# Altium project 3FingerRobotV2.PrjPcb
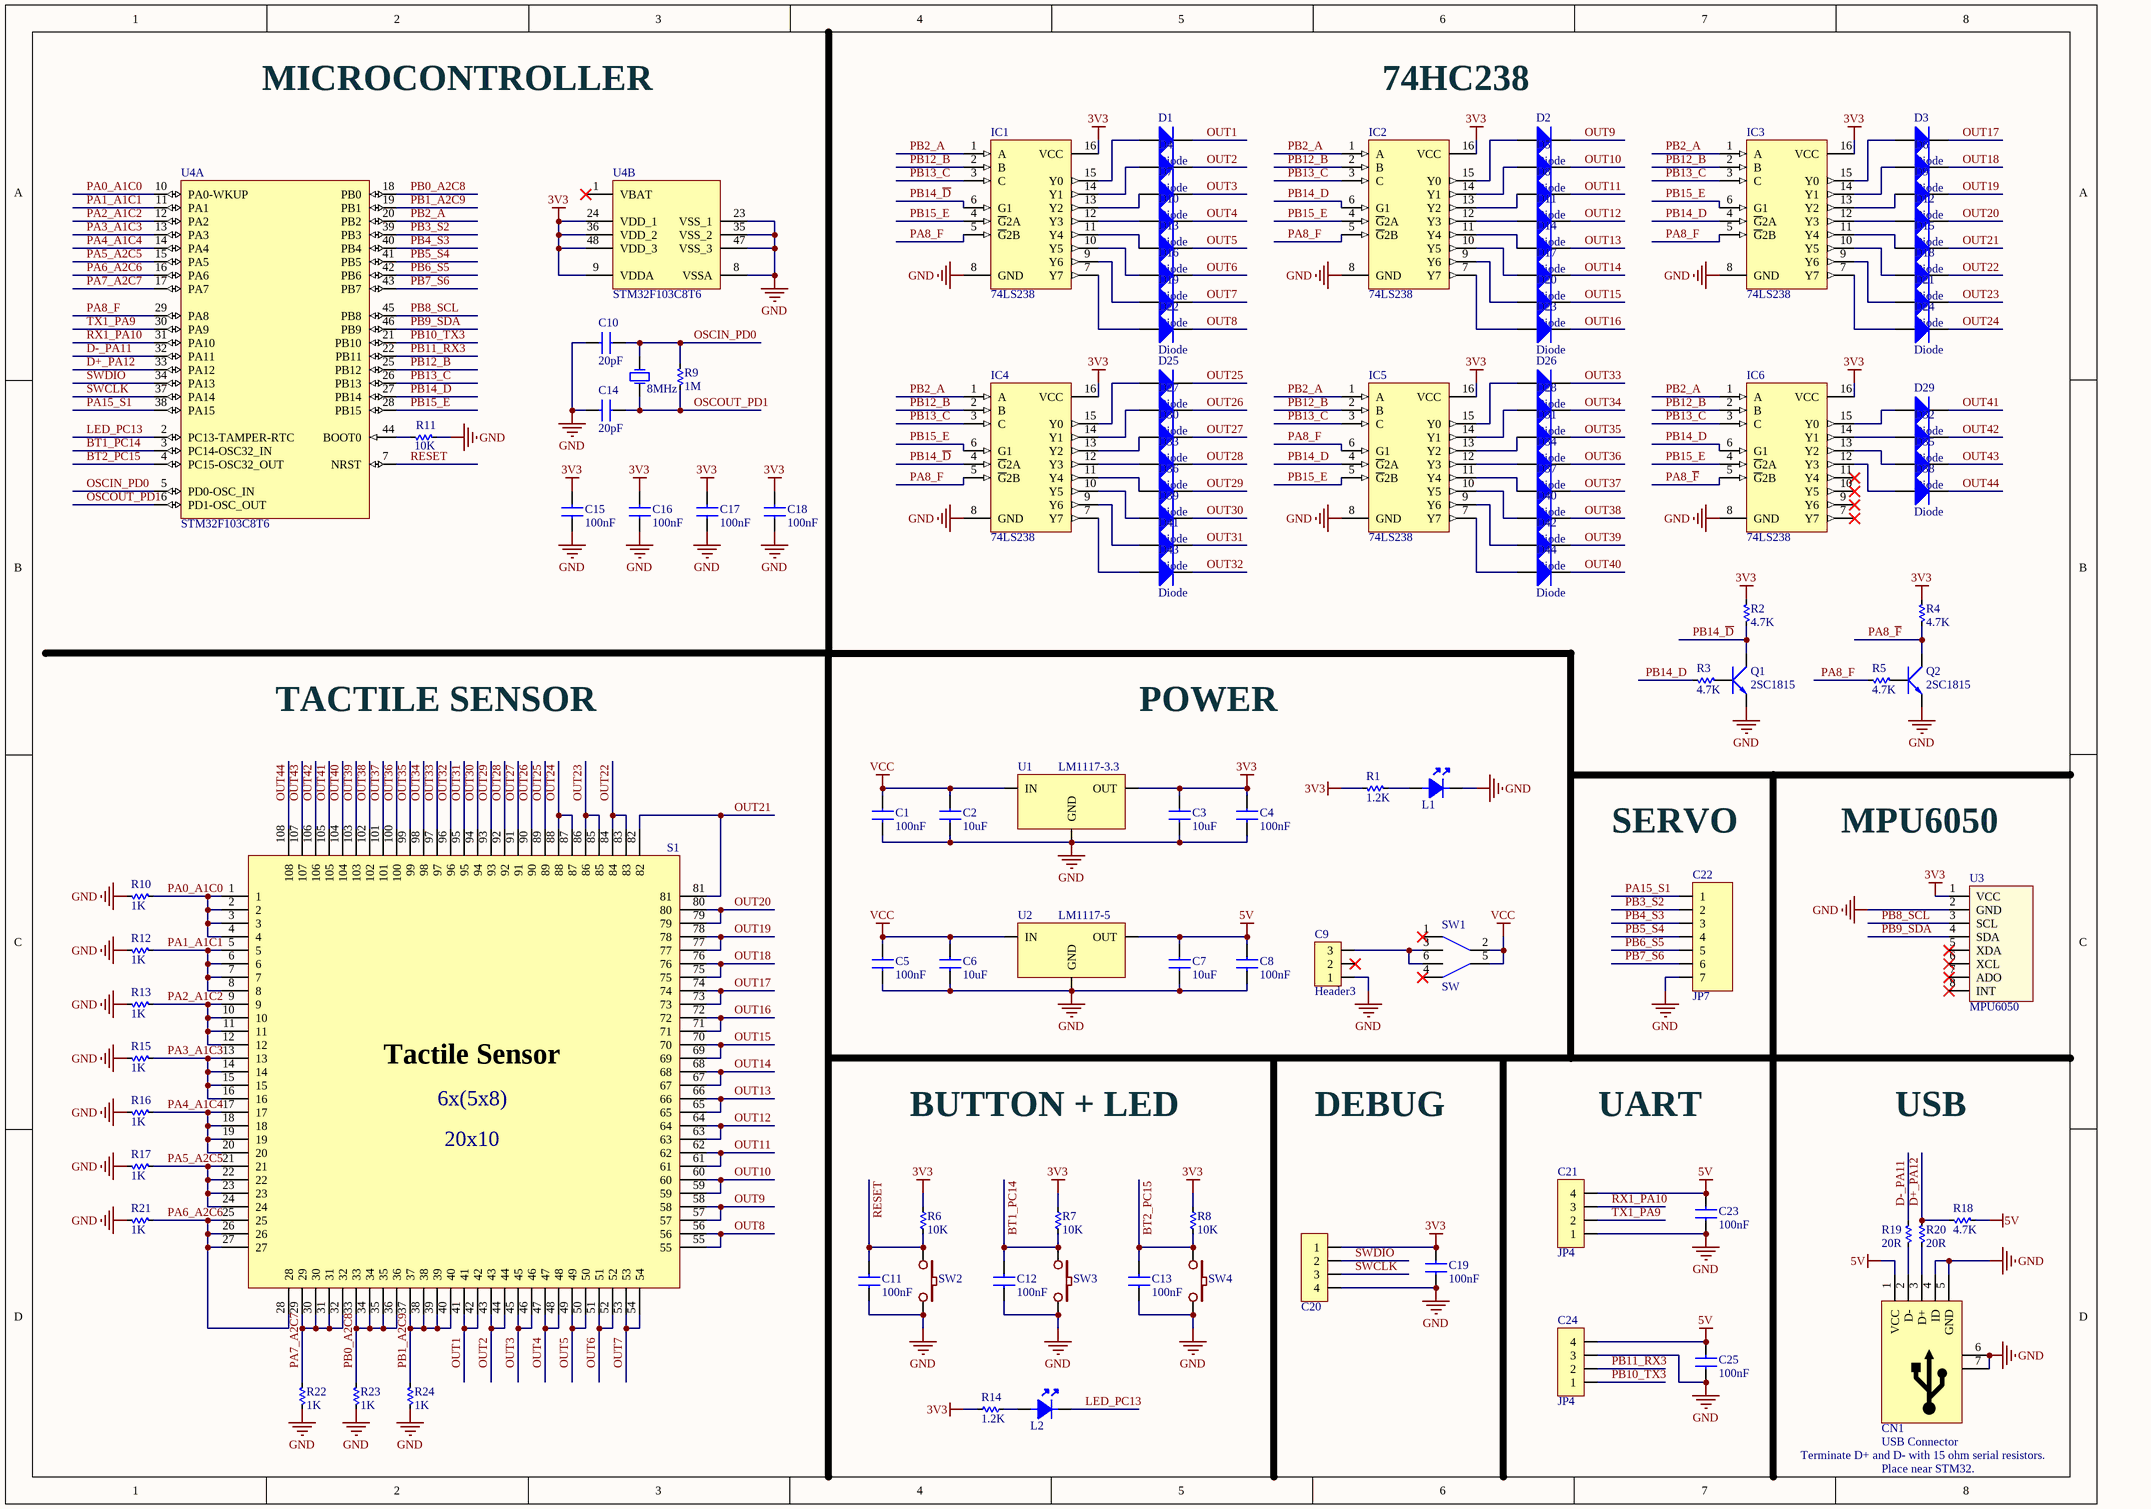
[diagram p0: 3FingerRobotV2.SchDoc]
1 sheet, 114 parts. Net scope: global (net labels, ports and power ports of the same name join across sheets).
Board file: 3FingerRobotV2.~(1).PcbDoc

## Sheet 3FingerRobotV2.SchDoc: Van Thinh
size A3; SheetNumber: 1; SheetTotal: 1; ENG_APP_DATE: --/--/--; DSN_APP_DATE: --/--/--; CHK_APP_DATE: --/--/--

### Parts
C1  Capacitance: 100nF  [C0805-2.01-1.25-0.94]  (hidden comment: Capacitor 0805)
C2  Capacitance: 10uF  [C0805-2.01-1.25-0.94]  (hidden comment: Capacitor 0805)
C3  Capacitance: 10uF  [C0805-2.01-1.25-0.94]  (hidden comment: Capacitor 0805)
C4  Capacitance: 100nF  [C0805-2.01-1.25-0.94]  (hidden comment: Capacitor 0805)
C5  Capacitance: 100nF  [C0805-2.01-1.25-0.94]  (hidden comment: Capacitor 0805)
C6  Capacitance: 10uF  [C0805-2.01-1.25-0.94]  (hidden comment: Capacitor 0805)
C7  Capacitance: 10uF  [C0805-2.01-1.25-0.94]  (hidden comment: Capacitor 0805)
C8  Capacitance: 100nF  [C0805-2.01-1.25-0.94]  (hidden comment: Capacitor 0805)
C9  Header3  [Header3]
C10  Capacitance: 20pF  [C0603-1.6-0.8-0.8]  (hidden comment: Capacitor 0603)
C11  Capacitance: 100nF  [C0603-1.6-0.8-0.8]  (hidden comment: Capacitor 0603)
C12  Capacitance: 100nF  [C0603-1.6-0.8-0.8]  (hidden comment: Capacitor 0603)
C13  Capacitance: 100nF  [C0603-1.6-0.8-0.8]  (hidden comment: Capacitor 0603)
C14  Capacitance: 20pF  [C0603-1.6-0.8-0.8]  (hidden comment: Capacitor 0603)
C15  Capacitance: 100nF  [C0603-1.6-0.8-0.8]  (hidden comment: Capacitor 0603)
C16  Capacitance: 100nF  [C0603-1.6-0.8-0.8]  (hidden comment: Capacitor 0603)
C17  Capacitance: 100nF  [C0603-1.6-0.8-0.8]  (hidden comment: Capacitor 0603)
C18  Capacitance: 100nF  [C0603-1.6-0.8-0.8]  (hidden comment: Capacitor 0603)
C19  Capacitance: 100nF  [C0603-1.6-0.8-0.8]  (hidden comment: Capacitor 0603)
C20  HEADER 4 HORIZONTAL  [HDR1X4H]  (value not drawn)
C21  JP4  [JP4-C1C]
C22  JP7  [JP7-D1T]
C23  Capacitance: 100nF  [C0603-1.6-0.8-0.8]  (hidden comment: Capacitor 0603)
C24  JP4  [JP4-C1C]
C25  Capacitance: 100nF  [C0603-1.6-0.8-0.8]  (hidden comment: Capacitor 0603)
CN1  USB Connector  [USB-B-Micro-Hole]
D1  Diode  [SOD-123F]
D2  Diode  [SOD-123F]
D3  Diode  [SOD-123F]
D4  Diode  [SOD-123F]
D5  Diode  [SOD-123F]
D6  Diode  [SOD-123F]
D7  Diode  [SOD-123F]
D8  Diode  [SOD-123F]
D9  Diode  [SOD-123F]
D10  Diode  [SOD-123F]
D11  Diode  [SOD-123F]
D12  Diode  [SOD-123F]
D13  Diode  [SOD-123F]
D14  Diode  [SOD-123F]
D15  Diode  [SOD-123F]
D16  Diode  [SOD-123F]
D17  Diode  [SOD-123F]
D18  Diode  [SOD-123F]
D19  Diode  [SOD-123F]
D20  Diode  [SOD-123F]
D21  Diode  [SOD-123F]
D22  Diode  [SOD-123F]
D23  Diode  [SOD-123F]
D24  Diode  [SOD-123F]
D25  Diode  [SOD-123F]
D26  Diode  [SOD-123F]
D27  Diode  [SOD-123F]
D28  Diode  [SOD-123F]
D29  Diode  [SOD-123F]
D30  Diode  [SOD-123F]
D31  Diode  [SOD-123F]
D32  Diode  [SOD-123F]
D33  Diode  [SOD-123F]
D34  Diode  [SOD-123F]
D35  Diode  [SOD-123F]
D36  Diode  [SOD-123F]
D37  Diode  [SOD-123F]
D38  Diode  [SOD-123F]
D39  Diode  [SOD-123F]
D40  Diode  [SOD-123F]
D41  Diode  [SOD-123F]
D42  Diode  [SOD-123F]
D43  Diode  [SOD-123F]
D44  Diode  [SOD-123F]
IC1  74LS238  [SO16]
IC2  74LS238  [SO16]
IC3  74LS238  [SO16]
IC4  74LS238  [SO16]
IC5  74LS238  [SO16]
IC6  74LS238  [SO16]
L1  LED 0603  [L0603-R]  (value not drawn)
L2  LED 0603  [L0603-R]  (value not drawn)
Q1  2SC1815  [SOT23-321]
Q2  2SC1815  [SOT23-321]
R1  Resistance: 1.2K  [R0603]  (hidden comment: Resistor 0603)
R2  Resistance: 4.7K  [R0603]  (hidden comment: Resistor 0603)
R3  Resistance: 4.7K  [R0603]  (hidden comment: Resistor 0603)
R4  Resistance: 4.7K  [R0603]  (hidden comment: Resistor 0603)
R5  Resistance: 4.7K  [R0603]  (hidden comment: Resistor 0603)
R6  Resistance: 10K  [R0603]  (hidden comment: Resistor 0603)
R7  Resistance: 10K  [R0603]  (hidden comment: Resistor 0603)
R8  Resistance: 10K  [R0603]  (hidden comment: Resistor 0603)
R9  Resistance: 1M  [R0603]  (hidden comment: Resistor 0603)
R10  Resistance: 1K  [R0603]  (hidden comment: Resistor 0603)
R11  Resistance: 10K  [R0603]  (hidden comment: Resistor 0603)
R12  Resistance: 1K  [R0603]  (hidden comment: Resistor 0603)
R13  Resistance: 1K  [R0603]  (hidden comment: Resistor 0603)
R14  Resistance: 1.2K  [R0603]  (hidden comment: Resistor 0603)
R15  Resistance: 1K  [R0603]  (hidden comment: Resistor 0603)
R16  Resistance: 1K  [R0603]  (hidden comment: Resistor 0603)
R17  Resistance: 1K  [R0603]  (hidden comment: Resistor 0603)
R18  Resistance: 4.7K  [R0603]  (hidden comment: Resistor 0603)
R19  Resistance: 20R  [R0603]  (hidden comment: Resistor 0603)
R20  Resistance: 20R  [R0603]  (hidden comment: Resistor 0603)
R21  Resistance: 1K  [R0603]  (hidden comment: Resistor 0603)
R22  Resistance: 1K  [R0603]  (hidden comment: Resistor 0603)
R23  Resistance: 1K  [R0603]  (hidden comment: Resistor 0603)
R24  Resistance: 1K  [R0603]  (hidden comment: Resistor 0603)
S1  TactileMatrix  [tactilematrix]  (value not drawn)
SW1  SW  [SK-22D07]
SW2  SW  [SW-SMD]  (value not drawn)
SW3  SW  [SW-SMD]  (value not drawn)
SW4  SW  [SW-SMD]  (value not drawn)
U1  LM1117-3.3  [SOT223-4N]
U2  LM1117-5  [SOT223-4N]
U3  MPU6050  [MPU-6050]
U4  STM32F103C8T6  [STM-LQFP48_L]  (parts A,B of 2)
Y1  8MHz  [XTAL_SMD]

### Nets
3V3: C3.2 C4.2 C15.2 C16.2 C17.2 C18.2 C19.2 C20.1 IC1.16(VCC) IC2.16(VCC) IC3.16(VCC) IC4.16(VCC) IC5.16(VCC) IC6.16(VCC) R1.2 R2.2 R4.2 R6.1 R7.1 R8.1 R14.1 U1.2(OUT) U3.1(VCC) U4.9(VDDA) U4.24(VDD_1) U4.36(VDD_2) U4.48(VDD_3)
5V: C7.2 C8.2 C21.4 C23.2 C24.4 C25.2 CN1.1(VCC) R18.1 U2.2(OUT)
GND: C1.1 C2.1 C3.1 C4.1 C5.1 C6.1 C7.1 C8.1 C9.1 C10.1 C11.2 C12.2 C13.2 C14.1 C15.1 C16.1 C17.1 C18.1 C19.1 C20.4 C21.1 C22.7 C23.1 C24.3 C25.1 CN1.4(ID) CN1.5(GND) CN1.6(SHIELD) CN1.7(SHIELD) IC1.8(GND) IC2.8(GND) IC3.8(GND) IC4.8(GND) IC5.8(GND) IC6.8(GND) L1.1(K) Q1.1(E) Q2.1(E) R10.1 R11.2 R12.1 R13.1 R15.1 R16.1 R17.1 R21.1 R22.1 R23.1 R24.1 SW2.1 SW3.1 SW4.1 U1.1(GND) U2.1(GND) U3.2(GND) U4.8(VSSA) U4.23(VSS_1) U4.35(VSS_2) U4.47(VSS_3)
VCC: C1.2 C2.2 C5.2 C6.2 SW1.2 SW1.5 U1.3(IN) U2.3(IN)
BT1_PC14: C12.1 R7.2 SW3.2 U4.3(PC14-OSC32_IN)
BT2_PC15: C13.1 R8.2 SW4.2 U4.4(PC15-OSC32_OUT)
D+_PA12: R18.2 R20.1 U4.33(PA12)
D-_PA11: R19.1 U4.32(PA11)
LED_PC13: L2.1(K) U4.2(PC13-TAMPER-RTC)
OSCIN_PD0: C10.2 R9.2 U4.5(PD0-OSC_IN) Y1.1(OSC1)
OSCOUT_PD1: C14.2 R9.1 U4.6(PD1-OSC_OUT) Y1.2(OSC2)
OUT1: D1.2(K) S1.41 S1.42
OUT2: D4.2(K) S1.43 S1.44
OUT3: D7.2(K) S1.45 S1.46
OUT4: D10.2(K) S1.47 S1.48
OUT5: D13.2(K) S1.49 S1.50
OUT6: D16.2(K) S1.51 S1.52
OUT7: D19.2(K) S1.53 S1.54
OUT8: D22.2(K) S1.55 S1.56
OUT9: D2.2(K) S1.57 S1.58
OUT10: D5.2(K) S1.59 S1.60
OUT11: D8.2(K) S1.61 S1.62
OUT12: D11.2(K) S1.63 S1.64
OUT13: D14.2(K) S1.65 S1.66
OUT14: D17.2(K) S1.67 S1.68
OUT15: D20.2(K) S1.69 S1.70
OUT16: D23.2(K) S1.71 S1.72
OUT17: D3.2(K) S1.73 S1.74
OUT18: D6.2(K) S1.75 S1.76
OUT19: D9.2(K) S1.77 S1.78
OUT20: D12.2(K) S1.79 S1.80
OUT21: D15.2(K) S1.81 S1.82
OUT22: D18.2(K) S1.83 S1.84
OUT23: D21.2(K) S1.85 S1.86
OUT24: D24.2(K) S1.87 S1.88
OUT25: D25.2(K) S1.89
OUT26: D27.2(K) S1.90
OUT27: D30.2(K) S1.91
OUT28: D33.2(K) S1.92
OUT29: D36.2(K) S1.93
OUT30: D39.2(K) S1.94
OUT31: D41.2(K) S1.95
OUT32: D43.2(K) S1.96
OUT33: D26.2(K) S1.97
OUT34: D28.2(K) S1.98
OUT35: D31.2(K) S1.99
OUT36: D34.2(K) S1.100
OUT37: D37.2(K) S1.101
OUT38: D40.2(K) S1.102
OUT39: D42.2(K) S1.103
OUT40: D44.2(K) S1.104
OUT41: D29.2(K) S1.105
OUT42: D32.2(K) S1.106
OUT43: D35.2(K) S1.107
OUT44: D38.2(K) S1.108
PA0_A1C0: R10.2 S1.1 S1.2 S1.3 S1.4 U4.10(PA0-WKUP)
PA1_A1C1: R12.2 S1.5 S1.6 S1.7 S1.8 U4.11(PA1)
PA2_A1C2: R13.2 S1.9 S1.10 S1.11 S1.12 U4.12(PA2)
PA3_A1C3: R15.2 S1.13 S1.14 S1.15 S1.16 U4.13(PA3)
PA4_A1C4: R16.2 S1.17 S1.18 S1.19 S1.20 U4.14(PA4)
PA5_A2C5: R17.2 S1.21 S1.22 S1.23 S1.24 U4.15(PA5)
PA6_A2C6: R21.2 S1.25 S1.26 S1.27 S1.28 U4.16(PA6)
PA7_A2C7: R22.2 S1.29 S1.30 S1.31 S1.32 U4.17(PA7)
PA8_F: IC1.5(~{G}2B) IC2.5(~{G}2B) IC3.5(~{G}2B) IC4.5(~{G}2B) IC5.6(G1) R5.1 U4.29(PA8)
PA8_~{F}: IC6.5(~{G}2B) Q2.2(C) R4.1
PA15_S1: C22.1 U4.38(PA15)
PB0_A2C8: R23.2 S1.33 S1.34 S1.35 S1.36 U4.18(PB0)
PB1_A2C9: R24.2 S1.37 S1.38 S1.39 S1.40 U4.19(PB1)
PB2_A: IC1.1(A) IC2.1(A) IC3.1(A) IC4.1(A) IC5.1(A) IC6.1(A) U4.20(PB2)
PB3_S2: C22.2 U4.39(PB3)
PB4_S3: C22.3 U4.40(PB4)
PB5_S4: C22.4 U4.41(PB5)
PB6_S5: C22.5 U4.42(PB6)
PB7_S6: C22.6 U4.43(PB7)
PB8_SCL: U3.3(SCL) U4.45(PB8)
PB9_SDA: U3.4(SDA) U4.46(PB9)
PB10_TX3: C24.1 U4.21(PB10)
PB11_RX3: C24.2 U4.22(PB11)
PB12_B: IC1.2(B) IC2.2(B) IC3.2(B) IC4.2(B) IC5.2(B) IC6.2(B) U4.25(PB12)
PB13_C: IC1.3(C) IC2.3(C) IC3.3(C) IC4.3(C) IC5.3(C) IC6.3(C) U4.26(PB13)
PB14_D: IC2.6(G1) IC3.4(~{G}2A) IC5.4(~{G}2A) IC6.6(G1) R3.1 U4.27(PB14)
PB14_~{D}: IC1.6(G1) IC4.4(~{G}2A) Q1.2(C) R2.1
PB15_E: IC1.4(~{G}2A) IC2.4(~{G}2A) IC3.6(G1) IC4.6(G1) IC5.5(~{G}2B) IC6.4(~{G}2A) U4.28(PB15)
RESET: C11.1 R6.2 SW2.2 U4.7(NRST)
RX1_PA10: C21.3 U4.31(PA10)
SWCLK: C20.3 U4.37(PA14)
SWDIO: C20.2 U4.34(PA13)
TX1_PA9: C21.2 U4.30(PA9)
NetC9_3: C9.3 SW1.3 SW1.6
NetCN1_2: CN1.2(D-) R19.2
NetCN1_3: CN1.3(D+) R20.2
NetD1_1: D1.1(A) IC1.15(Y0)
NetD2_1: D2.1(A) IC2.15(Y0)
NetD3_1: D3.1(A) IC3.15(Y0)
NetD4_1: D4.1(A) IC1.14(Y1)
NetD5_1: D5.1(A) IC2.14(Y1)
NetD6_1: D6.1(A) IC3.14(Y1)
NetD7_1: D7.1(A) IC1.13(Y2)
NetD8_1: D8.1(A) IC2.13(Y2)
NetD9_1: D9.1(A) IC3.13(Y2)
NetD10_1: D10.1(A) IC1.12(Y3)
NetD11_1: D11.1(A) IC2.12(Y3)
NetD12_1: D12.1(A) IC3.12(Y3)
NetD13_1: D13.1(A) IC1.11(Y4)
NetD14_1: D14.1(A) IC2.11(Y4)
NetD15_1: D15.1(A) IC3.11(Y4)
NetD16_1: D16.1(A) IC1.10(Y5)
NetD17_1: D17.1(A) IC2.10(Y5)
NetD18_1: D18.1(A) IC3.10(Y5)
NetD19_1: D19.1(A) IC1.9(Y6)
NetD20_1: D20.1(A) IC2.9(Y6)
NetD21_1: D21.1(A) IC3.9(Y6)
NetD22_1: D22.1(A) IC1.7(Y7)
NetD23_1: D23.1(A) IC2.7(Y7)
NetD24_1: D24.1(A) IC3.7(Y7)
NetD25_1: D25.1(A) IC4.15(Y0)
NetD26_1: D26.1(A) IC5.15(Y0)
NetD27_1: D27.1(A) IC4.14(Y1)
NetD28_1: D28.1(A) IC5.14(Y1)
NetD29_1: D29.1(A) IC6.15(Y0)
NetD30_1: D30.1(A) IC4.13(Y2)
NetD31_1: D31.1(A) IC5.13(Y2)
NetD32_1: D32.1(A) IC6.14(Y1)
NetD33_1: D33.1(A) IC4.12(Y3)
NetD34_1: D34.1(A) IC5.12(Y3)
NetD35_1: D35.1(A) IC6.13(Y2)
NetD36_1: D36.1(A) IC4.11(Y4)
NetD37_1: D37.1(A) IC5.11(Y4)
NetD38_1: D38.1(A) IC6.12(Y3)
NetD39_1: D39.1(A) IC4.10(Y5)
NetD40_1: D40.1(A) IC5.10(Y5)
NetD41_1: D41.1(A) IC4.9(Y6)
NetD42_1: D42.1(A) IC5.9(Y6)
NetD43_1: D43.1(A) IC4.7(Y7)
NetD44_1: D44.1(A) IC5.7(Y7)
NetL1_2: L1.2(A) R1.1
NetL2_2: L2.2(A) R14.2
NetQ1_3: Q1.3(B) R3.2
NetQ2_3: Q2.3(B) R5.2
NetR11_1: R11.1 U4.44(BOOT0)

Not connected (* = marked no-connect by the designer): C9 2*; IC6 7(Y7)* 9(Y6)* 10(Y5)* 11(Y4)*; SW1 1* 4*; U3 5(XDA)* 6(XCL)* 7(ADO)* 8(INT)*; U4 1(VBAT)*

### Notes on the sheet
- MICROCONTROLLER
- 74HC238
- TACTILE SENSOR
- POWER
- SERVO
- MPU6050
- BUTTON + LED
- DEBUG
- UART
- USB
- Terminate D+ and D- with 15 ohm serial resistors.
- Place near STM32.
- THIS DOCUMENT AND THE DATA DISCLOSED HEREIN OR
- HEREWITH IS THE PROPERTY OF ALTIUM LIMITED AND MAY
- DWG NO:
- REVISION
- REV:
- DESCRIPTION
- DATE
- APPROVED
- BE FREELY DISTRIBUTED IN WHOLE. NO RIGHTS ARE
- RESERVED OR EXPRESS OR IMPLIED WARANTEE GIVEN.
- ENG:
- APPROVALS
- PROJECT
- DSN:
- CHK:
- REFERENCE DOCUMENTS
- PROJECT REVISION:
- TITLE
- DOCUMENT REVISION:
- DESIGN ITEM:
- BOM:
- FAB DWG:
- PCB DWG:
- ASSY DWG:
- SCALE:
- A3
- SIZE
- CAGE CODE
- FILE NAME
- DWG NO.
- SHEET
- OF
- REV
- (in symbol TactileMatrix) Tactile Sensor; 6x(5x8); 20x10

### Library data of the parts
C1-C8 = CAP 0805: CAP CER 50V 0805; Manufacturer: Panasonic; Manufacturer Part Number: ECJ-2FB1H104K; Tolerance: 10%; Dielectric: X7R; Supplier 1: Arrow Electronics; RoHS: Yes; Category: Ceramic Capacitors; Mount: Surface Mount; Case/Package: 0805; Case Code (Metric): 2012; Case Code (Imperial): 0805; Min Operating Temperature: -55°C; Max Operating Temperature: 125°C; Packaging: Tape and Reel; Package Quantity: 3000; Voltage Rating: 50V; Voltage Rating (DC): 50V; Length: 0.079inch; Width: 0.049inch; Thickness: 0.055inch; Depth: 1.25mm; RoHS Compliant: Yes; ComponentLink1URL: https://datasheet.ciiva.com/6267/ecj-general-6267311.pdf?src-supplier=Digi-Key; ComponentLink1Description: https://datasheet.ciiva.com/6267/ecj-general-6267311.pdf?src-supplier=Digi-Key; ComponentLink2URL: https://datasheet.ciiva.com/6267/ecj-general-6267304.pdf?src-supplier=Digi-Key; ComponentLink2Description: https://datasheet.ciiva.com/6267/ecj-general-6267304.pdf?src-supplier=Digi-Key; ComponentLink3URL: https://datasheet.ciiva.com/6267/ecj-general-6267308.pdf?src-supplier=Digi-Key; ComponentLink3Description: https://datasheet.ciiva.com/6267/ecj-general-6267308.pdf?src-supplier=Digi-Key; Supplier Part Number 1: ECJ-2FB1H104K
C9 = Header3: Header IDC, 3 x 1 Pin Vertical 2.54mm Pitch (Non-Boxed, Male); Manufacturer: W¨¹rth Elektronik eiSos GmbH; partNo: 613002143121; ComponentLink1 Description: Manufacturer; ComponentLink2 Description: Datasheet; NoPins: 02; Created Date: 29 March 2013; ComponentLink1URL: http://www.we-online.com; ComponentLink2URL: http://katalog.we-online.de/em/datasheet/6130xx143121.pdf; Created by: Karrer Zheng
C10-C19 C23 C25 = CAP 0603: Cap Ceramic 50V X7R 10% Pad SMD 0603 Soft Termination 125C T/R; Manufacturer: Samsung; Manufacturer Part Number: CL10B104KB8SFNC; Supplier 1: Digi-Key; RoHS: Yes; Category: Ceramic Capacitors; Stock 1: 65685; Pricing 1: 1=0.10000, 10=0.03100, 50=0.01660, 100=0.01360, 500=0.00974, 1000=0.00765 (USD); Mount: Surface Mount; Case/Package: 0603; Case Code (Metric): 1608; Case Code (Imperial): 0603; Contact Plating: Tin,Matte; Min Operating Temperature: -55°C; Max Operating Temperature: 125°C; Package Quantity: 4000; Packaging: Tape and Reel; Tolerance: 10%; Voltage Rating: 50V; Dielectric: X7R; Features: Soft Termination; Series: CL; Construction: Flat; Length: 1.6mm; Width: 0.031inch; Height: 0.8mm; Thickness: 0.035inch; Depth: 0.8mm; Radiation Hardening: No; Lead Free: Lead Free; RoHS Compliant: Yes; ComponentLink1URL: https://datasheet.ciiva.com/25714/cl10b104kb8sfnc-25714514.pdf?src-supplier=Digi-Key; ComponentLink1Description: https://datasheet.ciiva.com/25714/cl10b104kb8sfnc-25714514.pdf?src-supplier=Digi-Key; Supplier Part Number 1: 1276-1936-1-ND
C20 = HEADER 4H: CONN HEADER 4POS .100 R/A TIN; Manufacturer: Amphenol FCI; Manufacturer Part Number: 68016-404HLF; Color: Black; Connector Type: Male Pin; Gender: Male; Number of Positions: 4; Insulation Resistance: 5GR; Max Voltage Rating (AC): 1.5kV; Current Rating: 3A; Pitch: 2.54mm; Contact Post Length: 3.05mm; Supplier 1: Digi-Key; RoHS: Yes; Category: Headers and Wire Housings; Stock 1: 2250; Pricing 1: 1=0.19000, 10=0.17900, 100=0.12400, 500=0.10494, 1000=0.08586, 5000=0.07632, 10000=0.06917 (USD); Mount: Through Hole; Housing Material: Thermoplastic; Contact Plating: Tin; Contact Material: Bronze; Housing Color: Black; Min Operating Temperature: -65°C; Max Operating Temperature: 125°C; Termination: Solder; Number of Contacts: 4; Number of Rows: 1; Contact Gender: Male; Packaging: Bulk; Package Quantity: 100; Voltage Rating: 1.5kV; Orientation: Right Angle; Length: 10.16mm; Contact Mating Length: 0.23inch; Depth: 9.9mm; Radiation Hardening: No; Flammability Rating: UL94 V-0; Lead Free: Lead Free; ComponentLink1URL: https://datasheet.ciiva.com/10144/68015-10144694.pdf?src-supplier=Avnet; ComponentLink1Description: https://datasheet.ciiva.com/10144/68015-10144694.pdf?src-supplier=Avnet; ComponentLink2URL: https://datasheet.ciiva.com/721/68015-721854.pdf?src-supplier=Digi-Key; ComponentLink2Description: https://datasheet.ciiva.com/721/68015-721854.pdf?src-supplier=Digi-Key; Supplier Part Number 1: 609-3407-ND
C21 C24 = JP4: WR-PHD 2.54 mm Angled Socket Header; Manufacturer: W¨¹rth Elektronik eiSos GmbH; partNo: 613004143121; ComponentLink1 Description: Manufacturer; ComponentLink2 Description: Datasheet; NoPins: 04; Created Date: 29 March 2013; ComponentLink1URL: http://www.we-online.com; ComponentLink2URL: http://katalog.we-online.de/em/datasheet/6130xx143121.pdf; Created by: Karrer Zheng
C22 = JP7: WR-PHD 2.54 mm Angled Socket Header; Manufacturer: W¨¹rth Elektronik eiSos GmbH; partNo: 613007143121; ComponentLink1 Description: Manufacturer; ComponentLink2 Description: Datasheet; NoPins: 07; Created Date: 29 March 2013; ComponentLink1URL: http://www.we-online.com; ComponentLink2URL: http://katalog.we-online.de/em/datasheet/6130xx143121.pdf; Created by: Karrer Zheng
CN1 = USB_MICRO_TYPE_B
D1-D44 = DIODE: Default Diode; Published: 8-Jun-2000; LatestRevisionDate: 17-Jul-2002; LatestRevisionNote: Re-released for DXP Platform.; PackageVersion: Sep-1996; PackageReference: SMC; Publisher: Altium Limited; Code_JEDEC: DO-214-AB
IC1-IC6 = 74238: 3 -to- 8 Decoder - Out High; Value: 74LS238; Copyright by: VanDungEvn@Gmail.com
L1 L2 = LED 0603: Standard LEDs - SMD; Manufacturer: Broadcom Avago; Manufacturer Part Number: HSMN-C190; Lens Color: White; Lens Style: Diffused,Colorless,Rectangular; Viewing Angle: 170°; Forward Current: 20mA; Forward Voltage: 3.3V; Power Rating: 78mW; Luminous Intensity: 35mcd; Dominant Wavelength: 470nm; Lens Transparency: Diffused; Number of LEDs: 1; Supplier 1: Digi-Key; RoHS: Yes; Category: LEDs; Stock 1: 13113; Pricing 1: 1=0.94000, 10=0.61500, 100=0.40280, 1000=0.31800, 2000=0.29680 (USD); Mount: Surface Mount; Case/Package: 0603; Number of Pins: 2; Case Code (Metric): 1608; Case Code (Imperial): 0603; Min Operating Temperature: -40°C; Max Operating Temperature: 85°C; Packaging: Tape and Reel; Package Quantity: 4000; Test Current: 20mA; Wavelength: 470nm; Series: -; Length: 1.6mm; Width: 0.8mm; Height: 0.8mm; Radiation Hardening: No; Lead Free: Lead Free; RoHS Compliant: Yes; ComponentLink1URL: http://components.arrow.com/part/dataview/0323_00093753?src-supplier=Arrow+Europe; ComponentLink1Description: http://components.arrow.com/part/dataview/0323_00093753?src-supplier=Arrow+Europe; ComponentLink2URL: http://components.arrow.com/part/dataview/2134527S7239109N7786?src-supplier=Arrow+Electronics; ComponentLink2Description: http://components.arrow.com/part/dataview/2134527S7239109N7786?src-supplier=Arrow+Electronics; ComponentLink3URL: http://www.avagotech.com/docs/AV02-0592EN?src-supplier=Digi-Key; ComponentLink3Description: http://www.avagotech.com/docs/AV02-0592EN?src-supplier=Digi-Key; ComponentLink4URL: http://www.avagotech.com/docs/AV02-0592EN?src-supplier=Avnet+Europe; ComponentLink4Description: http://www.avagotech.com/docs/AV02-0592EN?src-supplier=Avnet+Europe; ComponentLink5URL: http://www.avagotech.com/docs/AV02-0592EN?src-supplier=Mouser; ComponentLink5Description: http://www.avagotech.com/docs/AV02-0592EN?src-supplier=Mouser; ComponentLink6URL: https://docs.broadcom.com/docs/AV02-0592EN?src-supplier=Digi-Key; ComponentLink6Description: https://docs.broadcom.com/docs/AV02-0592EN?src-supplier=Digi-Key; ComponentLink7URL: http://www.avagotech.com/docs/AV02-0592EN?src-supplier=Avnet; ComponentLink7Description: http://www.avagotech.com/docs/AV02-0592EN?src-supplier=Avnet; ComponentLink8URL: https://docs.broadcom.com/docs/AV00-0244EN?src-supplier=Digi-Key; ComponentLink8Description: https://docs.broadcom.com/docs/AV00-0244EN?src-supplier=Digi-Key; Supplier Part Number 1: 516-3238-1-ND
Q1 Q2 = 2SC1815: Trans NPN 50V 0.15A
R1-R24 = RES 0603: RES 1K, 5%, 0603, THICK FILM; Manufacturer: TE Connectivity; Manufacturer Part Number: CRGCQ0603J1K0; Max Power Dissipation: 100mW; Temperature Coefficient: 100ppm/°C; Supplier 1: Digi-Key; RoHS: Yes; Category: Chip SMD Resistors; Stock 1: 113979; Pricing 1: 1=0.10000, 10=0.01900, 100=0.00780, 1000=0.00352, 2500=0.00306 (USD); Case/Package: 0603; Case Code (Imperial): 0603; Case Code (Metric): 1608; Min Operating Temperature: -55°C; Max Operating Temperature: 155°C; Resistor Type: Thick Film; Features: Moisture Resistant,Automotive AEC-Q200; Packaging: Cut Tape; Tolerance: 5%; Number of Terminations: 2; RoHS Compliant: Yes; ComponentLink1URL: http://www.farnell.com/datasheets/2609223.pdf?src-supplier=Farnell; ComponentLink1Description: http://www.farnell.com/datasheets/2609223.pdf?src-supplier=Farnell; ComponentLink2URL: https://www.te.com/commerce/DocumentDelivery/DDEController?Action=srchrtrv&amp;DocNm=1773204-3&amp;DocType=DS&amp;DocLang=English&src-supplier=Digi-Key; ComponentLink2Description: https://www.te.com/commerce/DocumentDelivery/DDEController?Action=srchrtrv&amp;DocNm=1773204-3&amp;DocType=DS&amp;DocLang=English&src-supplier=Digi-Key; Supplier Part Number 1: A130091CT-ND
SW1 = Switch Slide
SW2-SW4 = SW2: Pushbutton switch 2 pin; Value: SW chip 2 pin; Circuit: SPST; Switch Function: On-Off; Current Rating (Amps): 50mA, 12VDC; Category: Pushbutton Switches
U1 U2 = LM1117: LDO VOLTAGE REGULATOR, 3.3V, 0.8A, SOT-223-3, FULL REEL; Input Voltage Min:-; Input Voltage Max:15V; Output Current:800mA; Dropout Voltage Vdo:1.2V; LDO Regulator Case Style:SOT-223; No. of Pins:3; Operating Temperature Min:0 C ;RoHS Compliant: No; Manufacturer: TI National Semiconductor; Manufacturer Part Number: LM1117MPX-3.3; Number of Outputs: 1; Max Input Voltage: 15V; Max Output Current: 800mA; Dropout Voltage: 1.2V; Min Supply Voltage: 4.75V; Polarity: Positive; Quiescent Current: 10mA; Accuracy: 1%; Output Type: Fixed; Supplier 1: Digi-Key; RoHS: No; Category: Voltage Regulators - Linear; Stock 1: 682; Pricing 1: 1=1.64000, 10=1.46300, 25=1.38920, 100=1.06660, 250=0.94256, 500=0.89294, 1000=0.69451 (USD); Mount: Surface Mount; Case/Package: SOT-223; Number of Pins: 4; Min Operating Temperature: -40°C; Max Operating Temperature: 125°C; Output Voltage: 3.3V; Packaging: Tape and Reel; Output Current: 800mA; Max Supply Voltage: 15V; Number of Regulators: 1; Min Current Limit: 800mA; Max Output Voltage: 3.3V; Termination: SMD/SMT; Output Voltage Accuracy: 1%; Current Rating: 800mA; Series: LM1117-3.3; REACH SVHC: No SVHC; Lead Free: Contains Lead; RoHS Compliant: No; ComponentLink1URL: https://datasheet.ciiva.com/8042/1882372-8042277.pdf?src-supplier=Element14; ComponentLink1Description: https://datasheet.ciiva.com/8042/1882372-8042277.pdf?src-supplier=Element14; ComponentLink2URL: https://datasheet.ciiva.com/1570/1831038-1570214.pdf?src-supplier=Farnell; ComponentLink2Description: https://datasheet.ciiva.com/1570/1831038-1570214.pdf?src-supplier=Farnell; ComponentLink3URL: https://datasheet.ciiva.com/1570/1772317-1570215.pdf?src-supplier=Farnell; ComponentLink3Description: https://datasheet.ciiva.com/1570/1772317-1570215.pdf?src-supplier=Farnell; Supplier Part Number 1: 296-41282-1-ND
U4 = STM32F103C8T6: ARM Cortex-M3 32-bit MCU, 64 KB Flash, 20 KB Internal RAM, 37 I/Os, 48-pin LQFP, -40 to 85 degC, Tray; A/D Converter: 2x12-bit (10 Channel); FLASH Size (Prog) (kB): 64; I/Os (High Current): 37; Internal RAM Size (kB): 20; Operating Frequency(F) (Processor speed) (MHz): 72; Supply Voltage(Vcc) min (V): 2; DatasheetVersion: Rev. 16; PackageVersion: Rev. 6, 06/2013; PackageReference: LQFP48; PackageDescription: 48-Pin Low Profile Quad Flat Package, 7 x 7 mm Body, 0.5 mm Pitch; Supplier 1: Digi-Key; Supplier Part Number 1: 497-6063-ND; Supplier 2: Farnell; Supplier Part Number 2: 1447637; Supplier 3: Newark; Supplier Part Number 3: 59M2182; Supplier 4: Newark; Supplier Part Number 4: 57P1222; Supplier 5: Mouser; Supplier Part Number 5: 511-STM32F103C8T6; Core: ARM Cortex-M3; Packing: Tray; Mounting Technology: Surface Mount; PartNumber: STM32F103C8T6; ComponentLink1Description: Manufacturer URL; ComponentLink1URL: http://www.st.com/web/en/home.html; ComponentLink2Description: Datasheet; ComponentLink2URL: http://www.st.com/st-web-ui/static/active/en/resource/technical/document/datasheet/CD00161566.pdf; ComponentLink3Description: Package Specification; ComponentLink3URL: http://www.st.com/st-web-ui/static/active/en/resource/technical/document/datasheet/DM00058181.pdf
Y1 = XTAL: Crystal Oscillator; Published: 8-Jun-2000; LatestRevisionDate: 17-Jul-2002; LatestRevisionNote: Re-released for DXP Platform.; PackageReference: R38; Publisher: Altium Limited